# Altium schematic sheet bluetooth.SchDoc
size Letter
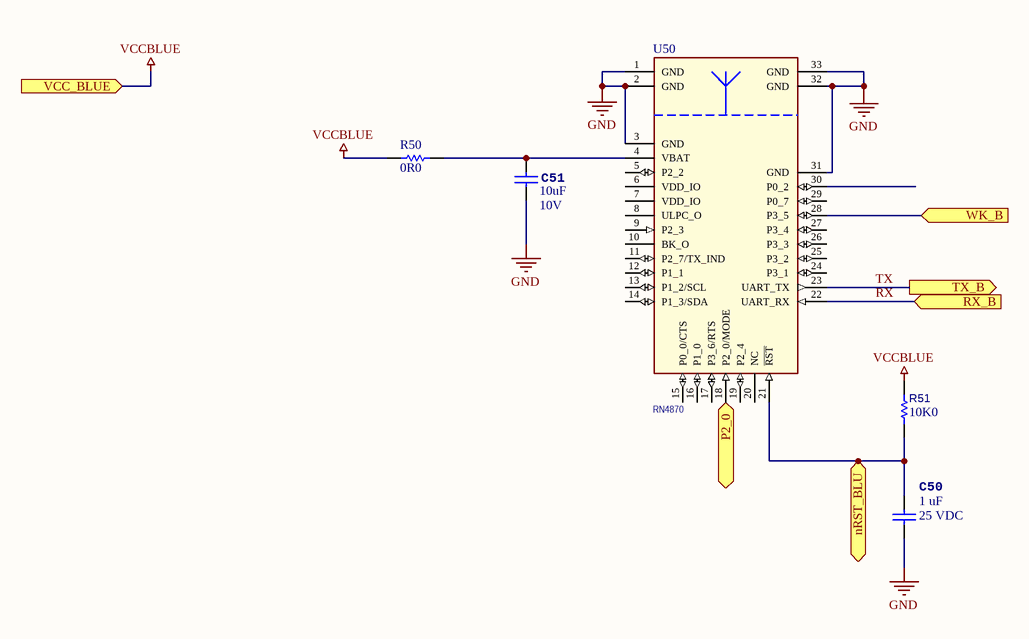
[diagram p0: bluetooth.SchDoc]

## Parts
C50  Capacitance: 1 uF  Voltage Rating DC: 25 VDC  [C0603]  (hidden comment: 1uF, 25V)
C51  Capacitance: 10uF  Voltage Rating DC: 10V  [C0402]  (hidden comment: ZRB15XR61A106ME01D)
R50  PANASONIC ELECTRONIC COMPONENTS  [0402_RES]  (value not drawn)
R51  Resistance: 10K0  [RESC0603]  (hidden comment: CRCW060310K0FKEB)
U50  value RN4870  [MOD_BM70BLES1FC2]  (hidden comment: 579-RN4870-I/RM140)

## Ports
nRST_BLU (in), P2_0 (in), RX_B (in), TX_B (out), VCC_BLUE (in), WK_B (in)

## Nets
GND: C50.2 C51.2 U50.1(GND) U50.2(GND) U50.3(GND) U50.31(GND) U50.32(GND) U50.33(GND)
VCCBLUE: R50.2 R51.1 ; port VCC_BLUE
nRST_BLU: C50.1 R51.2 U50.21(~{RST}) ; port nRST_BLU
P2_0: U50.18(P2_0/MODE) ; port P2_0
RX: U50.22(UART_RX) ; port RX_B
TX: U50.23(UART_TX) ; port TX_B
WK_B: U50.28(P3_5) ; port WK_B
NetC51_1: C51.1 R50.1 U50.4(VBAT)

Not connected (* = marked no-connect by the designer): U50 5(P2_2) 6(VDD_IO) 7(VDD_IO) 8(ULPC_O) 9(P2_3) 10(BK_O) 11(P2_7/TX_IND) 12(P1_1) 13(P1_2/SCL) 14(P1_3/SDA) 15(P0_0/CTS) 16(P1_0) 17(P3_6/RTS) 19(P2_4) 20(NC) 24(P3_1) 25(P3_2) 26(P3_3) 27(P3_4) 29(P0_7) 30(P0_2)

## Notes on the sheet
- Proyecto:
- CENTRO DE INGENIERIA Y DESARROLLO INDUSTRIAL
- Titulo:
- Fecha:
- Hoja:
- Elaborado por:
- de
- Hora:
- Revisión:
- Revisado por:
- CIDESI_template_letter

## Library data of the parts
C50 = 1uF, 25V: Cap_Cer; Manufacturer: Taiyo Yuden; Manufacturer Part Number: TMK107BLD105MA-T; Tolerance: 20 %; Capacitance - nF: 1000 nF; Dielectric: X5R; Product Status: New Product; Supplier 1: Mouser; RoHS: RoHS Compliant; Category: Multilayer Ceramic Capacitors MLCC - SMD/SMT; Stock 1: 6144; Pricing 1: 1=0.572, 10=0.280, 100=0.199, 500=0.179, 1000=0.152, 4000=0.152, 8000=0.118, 12000=0.108, 24000=0.104 (MXN); Height: 0.8 mm; Length: 1.6 mm; Package / Case: 0603 (1608 metric); Packaging: Cut Tape; Product: General Type MLCCs; Series: M; Termination Style: SMD/SMT; Width: 0.8 mm; Brand: Taiyo Yuden; Case Code - in: 0603; Case Code - mm: 1608; Maximum Operating Temperature: + 85 C; Minimum Operating Temperature: - 55 C; Product Type: Ceramic Capacitors; Standard Pack Qty: 4000; Subcategory: Capacitors; Termination: Standard; RoHS - Mouser: Y; Minimum Order Quantity: 1; Reeling: True; ComponentLink1URL: https://www.mouser.com/datasheet/2/396/mlcc02_e-1307760.pdf; ComponentLink1Description: https://www.mouser.com/datasheet/2/396/mlcc02_e-1307760.pdf; Supplier Part Number 1: 963-TMK107BLD105MA-T
C51 = 10uF, 10V: Cap_Cer; Manufacturer: Murata Electronics; Tolerance: 20 %; Type: General Purpose Multilayer Ceramic Chip Capacitor; Class: Class 2; Dielectric: X5R; Supplier 1: Mouser; Manufacturer Part Number: ZRB15XR61A106ME01D; RoHS: RoHS Compliant; Category: Multilayer Ceramic Capacitors MLCC - SMD/SMT; Stock 1: 361820; Pricing 1: 1=0.624, 10=0.436, 100=0.261, 500=0.196, 1000=0.165, 2500=0.137, 5000=0.129, 8000=0.117, 24000=0.113 (MXN); Height: 0.65 mm; Length: 1 mm; Package / Case: 0402 (1005 metric); Packaging: Cut Tape; Product: General Type MLCCs; Series: ZRB; Termination Style: SMD/SMT; Width: 0.5 mm; Brand: Murata Electronics; Case Code - in: 0402; Case Code - mm: 1005; Maximum Operating Temperature: + 85 C; Minimum Operating Temperature: - 55 C; Product Type: Ceramic Capacitors; Standard Pack Qty: 8000; Subcategory: Capacitors; Termination: Interposer Substrate; RoHS - Mouser: Y; Minimum Order Quantity: 1; Reeling: True; ComponentLink1URL: https://www.mouser.com/datasheet/2/281/ZRB15XR61A106ME01-01-1771691.pdf; ComponentLink1Description: https://www.mouser.com/datasheet/2/281/ZRB15XR61A106ME01-01-1771691.pdf; Supplier Part Number 1: 81-ZRB15XR61A106ME1D
R50 = 0R0: Resistor; Manufacturer Part Number: ERJ-2GE0R00X; Product Range: ERJ2; Voltage Rating: 50; Resistor Case Style: 0402 [1005 Metric]; Power Rating: 100; Resistor Element Type: Thick Film; Supplier 1: Newark; Manufacturer: PANASONIC ELECTRONIC COMPONENTS; RoHS: YES; Stock 1: 130000; Pricing 1: 1=0.006, 10000=0.006 (USD); Resistance Tolerance: -; ComponentLink1URL: http://www.farnell.com/datasheets/2059623.pdf; ComponentLink1Description: http://www.farnell.com/datasheets/2059623.pdf; Supplier Part Number 1: 97W7189; Resistance: 0R0
R51 = 10K0,100mW: Resistor; Manufacturer: Vishay / Dale; Power Rating: 100 mW (1/10 W); Temperature Coefficient: 100 PPM / C; Tolerance: 1 %; Voltage Rating: 75 V; Qualification: AEC-Q200; Supplier 1: Mouser; Manufacturer Part Number: CRCW060310K0FKEB; RoHS: RoHS Compliant By Exemption; Category: Thick Film Resistors - SMD; Stock 1: 86899; Pricing 1: 1=0.130, 10=0.048, 100=0.020, 1000=0.013, 10000=0.008, 30000=0.005 (MXN); Application: Automotive Grade; Features: -; Height: 0.45 mm; Length: 1.55 mm; Package / Case: -; Packaging: Cut Tape; Product: Thick Film Resistors SMD; Series: D/CRCW e3; Technology: Thick Film; Termination Style: SMD/SMT; Type: Chip Resistor; Width: 0.85 mm; Brand: Vishay / Dale; Mounting Style: PCB Mount; Case Code - in: 0603; Case Code - mm: 1608; Maximum Operating Temperature: + 155 C; Minimum Operating Temperature: - 55 C; Product Type: Thick Film Resistors; Standard Pack Qty: 10000; Subcategory: Resistors; RoHS - Mouser: E; Minimum Order Quantity: 1; Reeling: True; ComponentLink1URL: https://www.mouser.com/datasheet/2/427/dcrcwe3-1762152.pdf; ComponentLink1Description: https://www.mouser.com/datasheet/2/427/dcrcwe3-1762152.pdf; Supplier Part Number 1: 71-CRCW060310K0FKEB
U50 = 579-RN4870-I/RM140: BLUETOOTH; Manufacturer: Microchip Technology; Antenna: Ceramic Chip; Data Rate: 10 kb/s; Frequency: 2.4 GHz; Frequency Range: 2.402 GHz to 2.48 GHz; Output Power: 0 dBm; Range: 50 m; Sensitivity: - 90 dBm; Shielding: Shielded; Interface Type: UART; Class: Bluetooth Low Energy (BLE); Modulation Technique: GFSK; Operating Supply Voltage: 3.3 V; Protocol: Bluetooth 5.0; Protocol - Bluetooth, BLE - 802.15.1: BLE; Product Status: New Product; Supplier 1: Mouser; Manufacturer Part Number: RN4870-I/RM140; RoHS: RoHS Compliant; Category: Bluetooth Modules (802.15.1); Stock 1: 157; Pricing 1: 1=9.14, 25=8.35 (MXN); Packaging: Tray; Product: Bluetooth Modules; Series: RN4870; Type: USB Adapter; Brand: Microchip Technology; Mounting Style: SMD/SMT; Maximum Operating Temperature: + 85 C; Minimum Operating Temperature: - 40 C; Product Type: Bluetooth Modules; Standard Pack Qty: 88; Subcategory: Wireless & RF Modules; RoHS - Mouser: Y; Minimum Order Quantity: 1; Reeling: False; ComponentLink1URL: https://www.mouser.com/datasheet/2/268/RN4870-71-Bluetooth-Low-Energy-Module-Data-Sheet-D-1658564.pdf; ComponentLink1Description: https://www.mouser.com/datasheet/2/268/RN4870-71-Bluetooth-Low-Energy-Module-Data-Sheet-D-1658564.pdf; Supplier Part Number 1: 579-RN4870-I/RM140